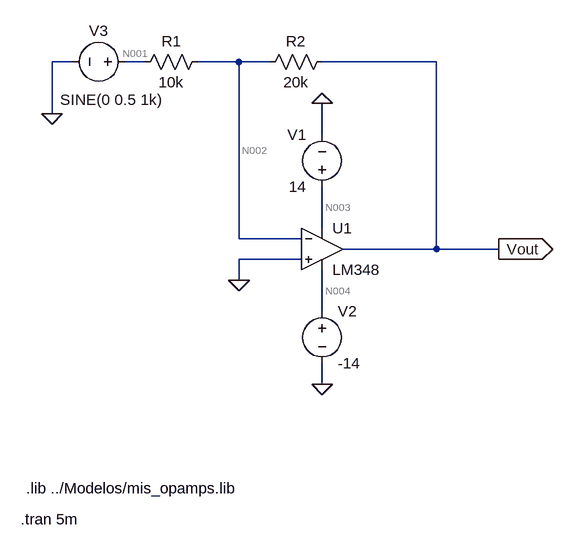
[diagram p0: schematic LM348.asc]
LM348.asc, the LTspice schematic file:
Version 4.1
SHEET 1 880 752
WIRE -160 32 -192 32
WIRE -48 32 -80 32
WIRE 96 32 32 32
WIRE 144 32 96 32
WIRE 400 32 224 32
WIRE -192 112 -192 32
WIRE 224 144 224 96
WIRE 224 288 224 224
WIRE 96 304 96 32
WIRE 192 304 96 304
WIRE 400 320 400 32
WIRE 400 320 256 320
WIRE 496 320 400 320
WIRE 192 336 96 336
WIRE 96 368 96 336
WIRE 224 416 224 352
WIRE 224 528 224 496
FLAG 224 96 0
FLAG 224 528 0
FLAG 96 368 0
FLAG 496 320 Vout
IOPIN 496 320 Out
FLAG -192 112 0
SYMBOL res 48 16 R90
WINDOW 0 0 56 VBottom 2
WINDOW 3 32 56 VTop 2
SYMATTR InstName R1
SYMATTR Value 10k
SYMBOL res 240 16 R90
WINDOW 0 0 56 VBottom 2
WINDOW 3 32 56 VTop 2
SYMATTR InstName R2
SYMATTR Value 20k
SYMBOL OpAmps\\opamp2 224 256 R0
SYMATTR InstName U1
SYMATTR Value LM348
SYMBOL voltage 224 240 R180
WINDOW 0 24 96 Left 2
WINDOW 3 24 16 Left 2
SYMATTR InstName V1
SYMATTR Value 14
SYMBOL voltage 224 400 R0
SYMATTR InstName V2
SYMATTR Value -14
SYMBOL voltage -64 32 R90
WINDOW 0 -32 56 VBottom 2
WINDOW 3 43 36 VTop 2
WINDOW 123 0 0 Left 0
WINDOW 39 0 0 Left 0
SYMATTR InstName V3
SYMATTR Value SINE(0 0.5 1k)
TEXT -232 688 Left 2 !.lib ../Modelos/mis_opamps.lib
TEXT -240 736 Left 2 !.tran 5m

The netlist it stands for:
* LM348.asc
R1 N002 N001 10k
R2 Vout N002 20k
X§U1 0 N002 N003 N004 Vout LM348  ; pins In+ In- V+ V- OUT
V1 N003 0 14
V2 N004 0 -14
V3 N001 0 SINE(0 0.5 1k)
.lib ../Modelos/mis_opamps.lib
.tran 5m
.backanno
.end

* Results of the author's LTspice run, read from the files saved beside the schematic
* Operating Point, zero values left out:
*   V(n002) = 9.458 µV
*   V(n003) = 14 V
*   V(n004) = -14 V
*   V(vout) = 626.4 µV
*   I(R1) = 945.8 pA
*   I(R2) = 30.85 nA
*   I(V1) = -561 µA
*   I(V2) = 561.1 µA
*   I(V3) = 945.8 pA
*   Ix(u1:1) = 29.89 nA
*   Ix(u1:2) = 29.9 nA
*   Ix(u1:3) = 561 µA
*   Ix(u1:4) = -561.1 µA
*   Ix(u1:5) = -30.85 nA
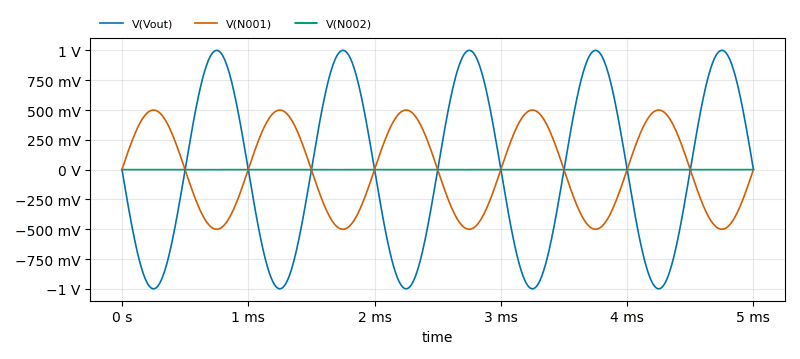
[diagram p1: Transient Analysis of LM348.asc, plotted from the saved traces]
* Transient Analysis, 1 run:
*   V(Vout): min -999.4 mV, max 1.001 V, average 626.3 µV, rms 707.1 mV, last 2.863 mV
*   V(N001): min -500 mV, max 500 mV, average 0 V, rms 353.6 mV, last 0 V
*   V(N002): min -733.8 µV, max 752.7 µV, average 9.418 µV, rms 525.6 µV, last 752.6 µV